# EAGLE design OSO-RING-B1-00 (never fabbed) (EAGLE 9.6.2)
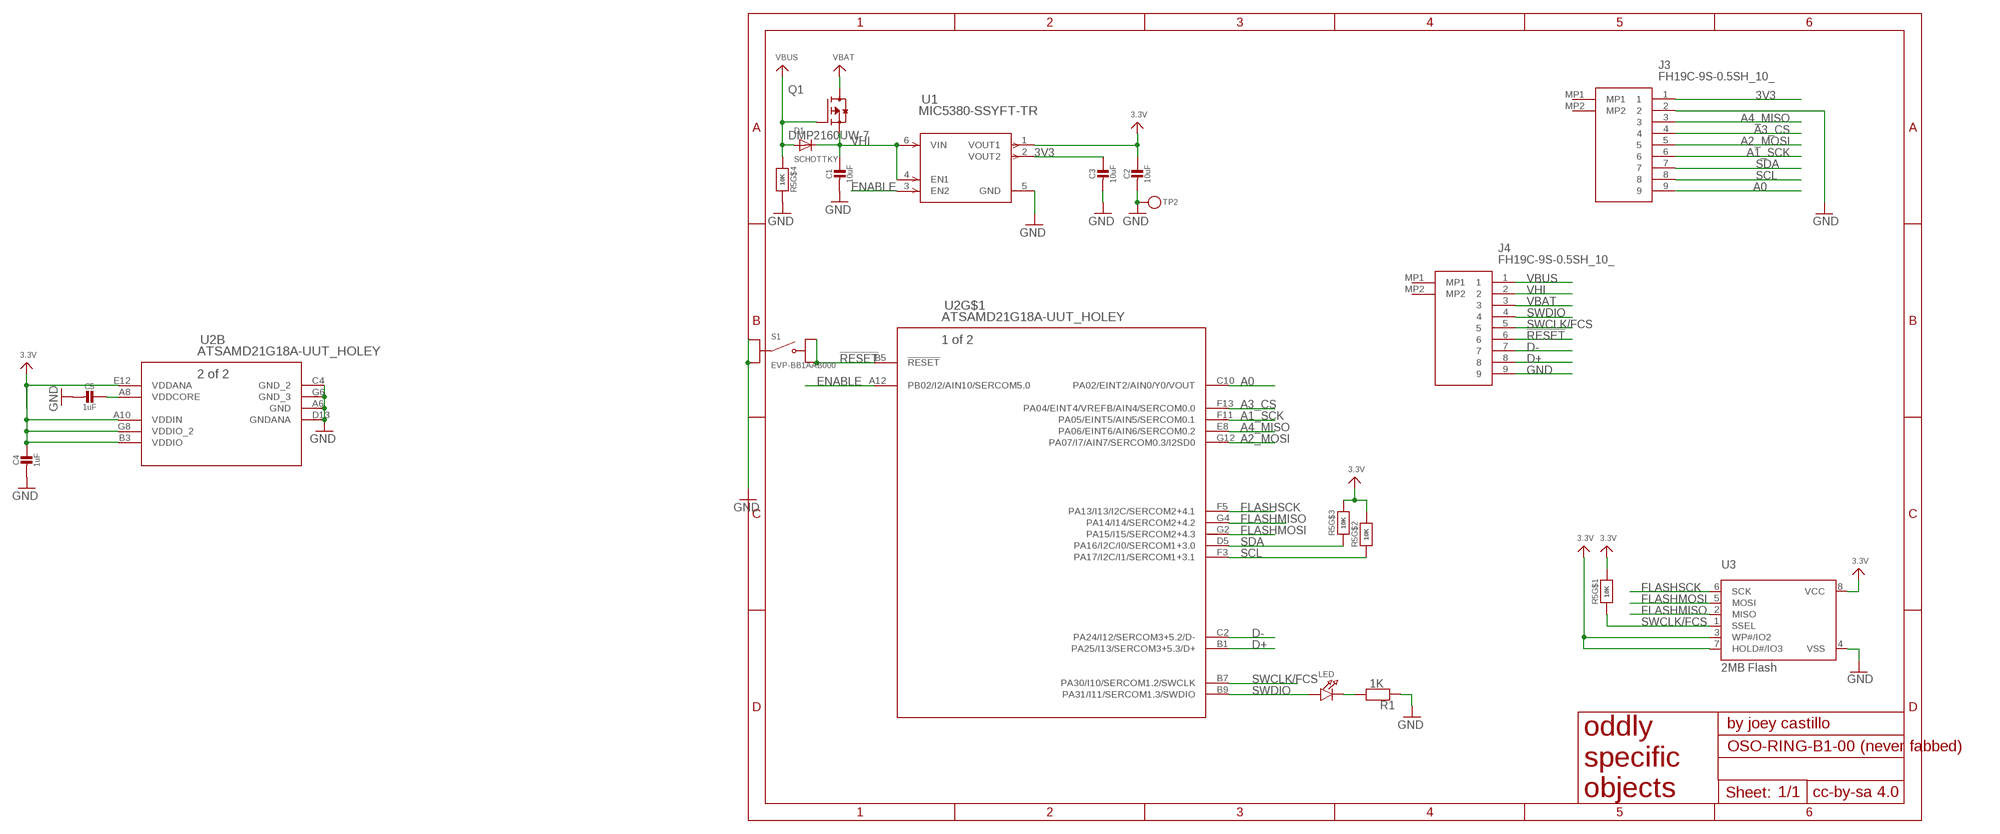
[diagram p0: schematic, sheet 1]

## Parts
C1  10uF  CAP_CERAMIC_0603MP  [_0603MP]
C2  10uF  CAP_CERAMIC_0603MP  [_0603MP]
C3  10uF  CAP_CERAMIC_0603MP  [_0603MP]
C4  1uF  CAP_CERAMIC_0603MP  [_0603MP]
C5  1uF  CAP_CERAMIC_0603MP  [_0603MP]
D1  SCHOTTKY  DIODESOD-323F  [SOD-323F]
J3  FH19C-9S-0.5SH_10_  [FH19C9S05SH10]
J4  FH19C-9S-0.5SH_10_  [FH19C9S05SH10]
LED  LED0603_NOOUTLINE  [CHIPLED_0603_NOOUTLINE]
Q1  DMP2160UW-7  [SOT65P210X110-3N]
R1  1K  RESISTOR_0603MP  [_0603MP]
R5  10K  EXB-V8V103JV-GOOD  [EXBV8V]
S1  EVP-BB1AAB000  [SW_EVP-BB1AAB000]
TP2  TESTPOINTPAD1MM  [TESTPOINT_PAD_1MM]
U1  MIC5380-SSYFT-TR  [TMLF-6_FT_MCH]
U2  ATSAMD21G18A-UUT_HOLEY  [WLCSP45_2P6X2P9_HOLEY]
U3  2MB Flash  SPIFLASH_8PINUX  [USON8]

## Nets
3.3V: C2.1 C4.1 R5.6 R5.7 R5.8 U1.1(VOUT1) U2.A10(B:VDDIN) U2.B3(B:VDDIO) U2.E12(B:VDDANA) U2.G8(B:VDDIO_2) U3.3(WP#/IO2) U3.7(HOLD#/IO3) U3.8(VCC)
3V3: C3.1 J3.1 U1.2(VOUT2)
!RESET: J4.6 S1.B1 S1.B2 U2.B5(!RESET)
A0: J3.9 U2.C10(PA02/EINT2/AIN0/Y0/VOUT)
A1_SCK: J3.6 U2.F11(PA05/EINT5/AIN5/SERCOM0.1)
A2_MOSI: J3.5 U2.G12(PA07/I7/AIN7/SERCOM0.3/I2SD0)
A3_CS: J3.4 U2.F13(PA04/EINT4/VREFB/AIN4/SERCOM0.0)
A4_MISO: J3.3 U2.E8(PA06/EINT6/AIN6/SERCOM0.2)
D+: J4.8 U2.B1(PA25/I13/SERCOM3+5.3/D+)
D-: J4.7 U2.C2(PA24/I12/SERCOM3+5.2/D-)
ENABLE: U1.3(EN2) U2.A12(PB02/I2/AIN10/SERCOM5.0)
FLASHMISO: U2.G4(PA14/I14/SERCOM2+4.2) U3.2(MISO)
FLASHMOSI: U2.G2(PA15/I15/SERCOM2+4.3) U3.5(MOSI)
FLASHSCK: U2.F5(PA13/I13/I2C/SERCOM2+4.1) U3.6(SCK)
GND: C1.2 C2.2 C3.2 C4.2 C5.2 J3.2 J4.9 R1.1 R5.5 S1.A1 S1.A2 TP2.P$1 U1.5(GND) U2.A6(B:GND) U2.C4(B:GND_2) U2.D13(B:GNDANA) U2.G6(B:GND_3) U3.4(VSS)
N$1: LED.C R1.2
SCL: J3.8 R5.2 U2.F3(PA17/I2C/I1/SERCOM1+3.1)
SDA: J3.7 R5.3 U2.D5(PA16/I2C/I0/SERCOM1+3.0)
SWCLK/FCS: J4.5 R5.1 U2.B7(PA30/I10/SERCOM1.2/SWCLK) U3.1(SSEL)
SWDIO: J4.4 LED.A U2.B9(PA31/I11/SERCOM1.3/SWDIO)
VBAT: J4.3 Q1.3(D)
VBUS: D1.A J4.1 Q1.1(G) R5.4
VDDCORE: C5.1 U2.A8(B:VDDCORE)
VHI: C1.1 D1.C J4.2 Q1.2(S) U1.4(EN1) U1.6(VIN)
Unconnected: J3.MP1 J3.MP2 J4.MP1 J4.MP2

## Library data of the parts
C1-C5 = microbuilder:CAP_CERAMIC: Ceramic Capacitors For new designs, use the packages preceded by an '_' character since they are more reliable: The following footprints should be used on most boards: _0402 - Standard footprint for regular board layouts _0603 - Standard footprint for regular board layouts _0805 - Standard footprint for regular board layouts _1206 - Standard footprint for regular board layouts For extremely tight-pitch boards where space is at a premium, the following 'micro-pitch' footprints can be used (smaller pads, no silkscreen outline, etc.): _0402MP - Micro-pitch footprint for very dense/compact boards _0603MP - Micro-pitch footprint for very dense/compact boards _0805MP - Micro-pitch footprint for very dense/compact boards _1206MP - Micro-pitch footprint for very dense/compact boards
D1 = adafruit:DIODE: Diode SMADIODE - SMA Surface Mount Package 20V 1A Schottky Diode Digikey: 641-1014-6-ND DO-1N4148 - Through Hole Small Current Diode SOD-123 20V 1 A (.5mV Vf) Schottky Diode - Digikey: MBRX120TPMSCT-ND SOD-323 10V 570mA (.38mV Vf, 3ns) Schottky Diode - Digikey: ZLLS410CT-ND SOD-523 30V 30mA Schottky Diode (RB751S-40TE61) - Digikey: RB751S-40TE61CT-ND SOT23-R/W - SOT23 Package (R = Solder Paste/Reflow Ovens, W = Hand-Soldering) BAT54Film 40V 300mA - Digikey: 497-7162-1-ND
J3 J4 = FH19C-9S-0.5SH:FH19C-9S-0.5SH_10_: CONN FFC BOTTOM 9POS 0.50MM R/A Source: Datasheet <https://componentsearchengine.com/Datasheets/1/FH19C-9S-0.5SH(10).pdf>; DESCRIPTION: CONN FFC BOTTOM 9POS 0.50MM R/A; HEIGHT: 1mm; MANUFACTURER_NAME: Hirose; MANUFACTURER_PART_NUMBER: FH19C-9S-0.5SH(10); MOUSER_PART_NUMBER: 798-FH19C9S05SH10; MOUSER_PRICE-STOCK: https://www.mouser.co.uk/ProductDetail/Hirose-Connector/FH19C-9S-05SH10?qs=vnk2wBG9e15bX8eK%2FvDSMA%3D%3D
LED = My Stuff:LED: LED 0603 - 0603 Surface Mount Package 2mA: Green LED - Low Power (3.9mcd, 2ma, 1.7Vf) - Digikey: 475-2709-2-ND Orange LED - Low Power (9.8mcd, 2ma, 1.8Vf) - Digikey: 475-1194-2-ND Red LED - Low Power (5mcd, 2ma, 1.8Vf) - Digikey: 475-1195-2-ND Yellow LED - Low Power (7mcd, 2ma, 1.8Vf) - Digikey: 475-1196-2-ND 5mA: Blue LED - Low Power (17mcd, 5ma, 2.9Vf) - Digikey: LNJ937W8CRACT-ND 0805 - 0805 Surface Mount Package 2mA: Red LED (8.8mcd, 2mA, 1.8Vf, Clear) - Low Power [Digikey: 475-2510-1-ND] Green LED (5mcd, 2mA, 1.8Vf, Clear) - Low Power [Digikey: 475-2730-1-ND] Yellow LED (11.3mcd, 2mA, 1.8Vf, Clear) - Low Power [Digikey: 475-2555-1-ND] 20mA: Red LED (104mcd, 20mA, Diffused) - LS R976 [Digikey: 475-1278-6-ND] Red LED (12mcd, 20mA, 2.0Vf, Clear) - APT2012EC [Digikey: 754-1128-1-ND] Green LED (15mcd, 20mA, 2.2Vf, Clear) - APT2012GC [Digikey: 754-1131-1-ND] Orange LED (160mcd, 20mA, 2.1Vf, Clear) - APT2012SECK [Digikey: 754-1130-1-ND] 1206 - 1206 Surface Mount Package Green LED (26mcd, 20mA, Diffused) - LG N971 [Digikey: 475-1407-6-ND] Red LED (15mcd, 20mA, Diffused) - LH N974 [Digikey: 475-1416-6-ND] Cree - Cree High-Power Surface Mount LEDs XPEBWT-L1-0000-00D50 - White 111lm 350mA 2.9Vf 6200K 110° XTEAWT-00-0000-00000LEE3 - White 114lm 350mA 2.85Vf 5000K 115° Everlight - Everlight 45-21 Series Surface Mount LEDs 45-21/QK2C-B2832AC2CB2/2T - Warm White 2000mcd 20mA 3.25Vf 3050K 120° 45-21/LK2C-B38452C4CB2/2T - Nuetral White 2000mcd 20mA 3.25Vf 4150K 120° 45-21/LK2C-B50634C6CB2/2T - Cold White 2200mcd 20mA 3.25Vf 5650K 120° PLCC2 Reverse Mount LS T77K-J1L2-1-0-2-R18-Z - Red 11.25mcd 2mA 1.8Vf 630nm 120° LO T77K-L1M2-24-Z - Orange 19.6mcd 2mA 1.8Vf 606nm 120° LY T77K-K2M1-26-Z - Yellow 15.7mcd 2mA 1.8Vf 587nm 120°
Q1 = DMP2160UW-7:DMP2160UW-7: DMP2160UW Series 20 V 100 mOhm P-Channel Enhancement Mode Mosfet - SOT-323; DESCRIPTION: P-Channel 20V 1.5A (Ta) 350mW (Ta) Surface Mount SOT-323; DIGI-KEY_PART_NUMBER: DMP2160UWDICT-ND; MF: Diodes Inc.; MP: DMP2160UW-7; PACKAGE: SOT-323 Diodes Inc.
R1 = microbuilder:RESISTOR: Resistors For new designs, use the packages preceded by an '_' character since they are more reliable: The following footprints should be used on most boards: _0402 - Standard footprint for regular board layouts _0603 - Standard footprint for regular board layouts _0805 - Standard footprint for regular board layouts _1206 - Standard footprint for regular board layouts For extremely tight-pitch boards where space is at a premium, the following 'micro-pitch' footprints can be used (smaller pads, no silkscreen outline, etc.): _0402MP - Micro-pitch footprint for very dense/compact boards _0603MP - Micro-pitch footprint for very dense/compact boards _0805MP - Micro-pitch footprint for very dense/compact boards _1206MP - Micro-pitch footprint for very dense/compact boards
R5 = resistor array:EXB-V8V103JV-GOOD; MANUFACTURER_PART_NUMBER: EXBV8V103JV; VENDOR: Panasonic
S1 = EVP-BB1AAB000:EVP-BB1AAB000: SWITCH TACTILE SPST-NO 0.02A 15V; DESCRIPTION: Tactile Switch SPST-NO Top Actuated Surface Mount; DIGI-KEY_PART_NUMBER: P124390CT-ND; MF: Panasonic Electronic Components; MP: EVP-BB1AAB000; PACKAGE: None; PURCHASE-URL: https://pricing.snapeda.com/search/part/EVP-BB1AAB000/?ref=eda
TP2 = pygamer-microbuilder:TESTPOINT: Test Point Various test points for characterisation and PCB testing TESTPOINT_SMT - Compact Surface Mount Test Point [Digikey: 5016KTR-ND]
U1 = MIC5380SSYFTTR:MIC5380-SSYFT-TR; BUILT_BY: EMA_Jessica; COPYRIGHT: Copyright (C) 2018 Accelerated Designs. All rights reserved; MANUFACTURER_PART_NUMBER: MIC5380-SSYFT-TR; SOURCELIBRARY: Microchip_2019-08-23_3; VENDOR: Microchip
U2 = ATSAMD21G18A-UUT:ATSAMD21G18A-UUT_HOLEY
U3 = microbuilder:SPIFLASH_8PIN: SOIC8 SPI Flash Be careful with the size since SOIC8 flash comes in several 'widths' SOIC8 150 mil M25P16 - 16Mbit (2Mbit x 8) Serial Flash (75MHz SPI Bus), Supply: 2.7-3.6V Digikey: SOIC8 - M25P16-VMN6P-ND SOIC8 208 mil W25Q16BVSSIG - 16Mbit (2Mbit x 8) Serial Flash (104MHz SPI Bus), Supply: 2.7-3.6V Digikey: SOIC8 - W25Q16BVSSIG-ND

## Net classes
1 power: width 0.305 mm

## Board
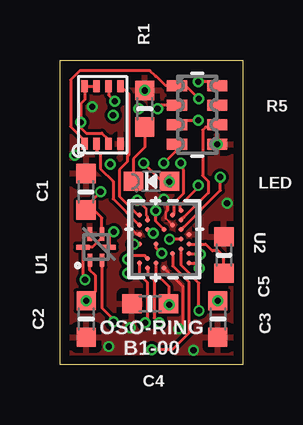
[diagram p1: board, top side]
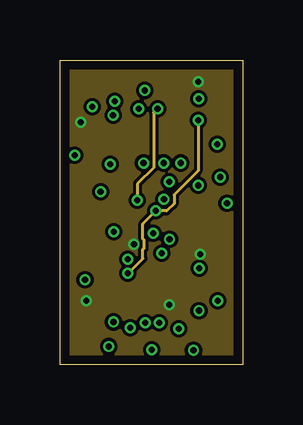
[diagram p2: board, inner layer Route2]
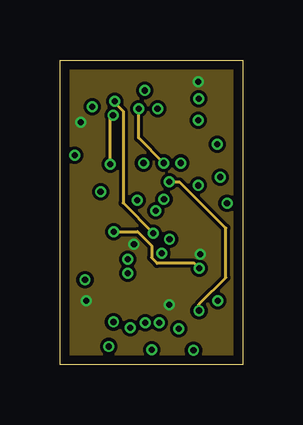
[diagram p3: board, inner layer Route15]
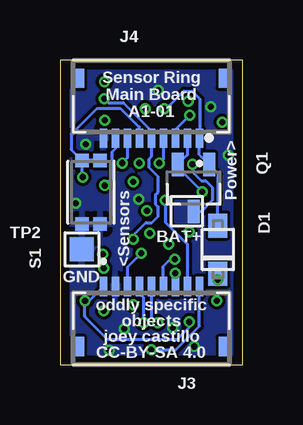
[diagram p4: board, bottom side, seen from below]

Size 7.62 x 12.7 mm. Coordinates in mm from the lower left corner, seen from the top.
Outline: 7.62,12.7 7.62,0 0,0 0,12.7 7.62,12.7
Copper layers (1*2*15*16): Top 0.035559375mm / dielectric 0.17018125mm / Route2 0.01778125mm / dielectric 47mil / Route15 0.01778125mm / dielectric 0.17018125mm / Bottom 0.035559375mm
Design rules "oshpark-4layer *": minimum track width 4mil, minimum drill 8mil, track to track 5mil, track to pad 5mil, pad to pad 5mil, via to via 5mil, smd to smd 5mil, copper to edge 15mil, drill to drill 6mil, minimum pad ring 4mil, minimum via ring 4mil, stop-mask expansion 1.5mil, vias tented up to drill 10mil, thermal gap 10mil

### Footprints (pad centres in the part's own frame; a part is rotated, then mirrored left to right if it is on the bottom)
_0603MP = smd 0.8 x 0.8: 1 -0.762,0; 2 0.762,0
SOD-323F = smd 1 x 0.8: A -1,0; C 1,0
FH19C9S05SH10 = smd 0.3 x 0.8: 1 -2,2.5; 2 -1.5,2.5; 3 -1,2.5; 4 -0.5,2.5; 5 0,2.5; 6 0.5,2.5; 7 1,2.5; 8 1.5,2.5; 9 2,2.5 | smd 0.4 x 0.8: MP1 -3,0; MP2 3,0
CHIPLED_0603_NOOUTLINE = smd 0.8 x 0.8: A 0,-0.75; C 0,0.75
SOT65P210X110-3N = smd 0.97 x 0.5: 1 -0.98,0.65; 2 -0.98,-0.65; 3 0.98,0
EXBV8V = smd 0.838 x 0.457: 1 -0.838,1.219; 2 -0.838,0.406; 3 -0.838,-0.406; 4 -0.838,-1.219; 5 0.838,-1.219; 6 0.838,-0.406; 7 0.838,0.406; 8 0.838,1.219
SW_EVP-BB1AAB000 = smd 0.55 x 0.55: A1 -1.325,0.375; A2 -1.325,-0.375; B1 1.325,0.375; B2 1.325,-0.375
TESTPOINT_PAD_1MM = smd 1 x 1: P$1 0,0
TMLF-6_FT_MCH = smd 0.559 x 0.203: 1 -0.546,0.25; 2 -0.546,-0.25; 4 0.546,-0.25; 5 0.546,0.25 | smd 0.203 x 0.559: 3 0,-0.546; 6 0,0.546
WLCSP45_2P6X2P9_HOLEY = smd 0.203 x 0.203: A6 -0.2,1.04; A8 0.2,1.04; A10 0.6,1.04; A12 1,1.04; B1 -1.2,0.693; B3 -0.8,0.693; B5 -0.4,0.693; B7 0,0.693; B9 0.4,0.693; C2 -1,0.346; C4 -0.6,0.346; C10 0.6,0.346; D5 -0.4,0; D13 1.2,0; E8 0.2,-0.346; E12 1,-0.346; F3 -0.8,-0.693; F5 -0.4,-0.693; F11 0.8,-0.693; F13 1.2,-0.693; G2 -1,-1.04; G4 -0.6,-1.04; G6 -0.2,-1.04; G8 0.2,-1.04; G12 1,-1.04
USON8 = smd 0.5 x 0.275: 1 -1.2,0.75; 2 -1.2,0.25; 3 -1.2,-0.25; 4 -1.2,-0.75; 5 1.2,-0.75; 6 1.2,-0.25; 7 1.2,0.25; 8 1.2,0.75

### Placement (x,y rotation side)
C1  1.09,7.21 90 top
C2  1.09,1.9 270 top
C3  6.58,1.9 270 top
C4  3.76,2.54 180 top
C5  6.83,4.57 90 top
D1  1.04,4.8 270 bottom
J3  3.81,0.76 0 bottom
J4  3.81,11.94 180 bottom
LED  3.81,7.65 90 top
Q1  2.06,7.37 270 bottom
R1  3.53,10.67 270 top
R5  5.71,10.41 0 top
S1  6.32,7.19 90 bottom
TP2  6.71,4.81 0 bottom
U1  1.5,4.9 90 top
U2  4.34,5.23 270 top
U3  1.78,10.41 90 top

### Tracks (layer width: path | path; a pad name or v marks a point on that pad's centre or on a via)
3.3V  (via drill 0.25)
  Top 0.127: U2.E12 4,3.8 4.52,3.28 C4.1 v4.56,2.51 | U3.7 U3.8 1.03,11.04 0.86,10.87 v0.86,10.11 0.86,9.88 1.09,9.65 1.74,9.65 2.03,9.37 U3.3 | v5.77,11.79 6.4,11.79 R5.8 R5.7 R5.6 6.45,9.91 6.07,9.91 5.94,9.78 5.94,7.88 6.18,7.65 6.18,7.16 5.16,6.14 5.14,6.14 U2.B3 | U1.1 1.25,3.95 1.48,3.72 1.48,3.05 C2.1 | U2.G8 v3.08,5.03 | U2.A10 5.82,4.63 v5.84,4.61
  other vias: 1.09,2.67
  pour Route15: -1.27,14.48 7.62,14.48 7.62,0 -1.27,0
  pour Route2: -1.52,14.48 7.62,14.48 7.62,0 -1.52,0
3V3  (via drill 0.25)
  Top 0.127: U1.2 1.75,2.37 2.23,1.89 v2.23,1.78
  Bottom 0.127: J3.1 6.41,2.67 C3.1 6.58,2.01 5.62,1.05 2.75,1.05 2.23,1.57 v2.23,1.78
  other vias: 6.58,2.67
!RESET  (via drill 0.25)
  Top 0.127: U2.B5 5.14,5.74 5.16,5.74 6.68,7.26 v6.68,7.82
  Bottom 0.127: v6.68,7.82 6.7,7.84 S1.B1 7.16,8.97 7.16,9.61 6.1,10.67 5.08,10.67 4.31,9.9 J4.6
  Bottom 0.152: S1.B1 S1.B2
A0  (via drill 0.25)
  Top 0.127: U2.C10 4.69,4.13 5.37,3.45 5.37,1.32 4.67,0.63 v3.82,0.63
  Bottom 0.127: v3.82,0.63 2.79,0.63 1.81,1.61 J3.9
A1_SCK  (via drill 0.25)
  Top 0.127: U2.F11 3.54,4.55 2.98,4.55 v2.83,4.39
  Bottom 0.127: v2.83,4.39 3.03,4.39 3.31,4.12 J3.6
A2_MOSI  (via drill 0.25)
  Top 0.127: v3.56,1.75 3.63,1.83 3.63,3.44 3.3,3.77 U2.G12
  Bottom 0.127: J3.5 3.81,2.01 v3.56,1.75
A3_CS  (via drill 0.25)
  Top 0.127: U2.F13 3.65,3.79 3.92,3.51 3.92,1.96 v4.14,1.74
  Bottom 0.127: v4.14,1.74 4.14,2.79 4.31,2.95 J3.4
A4_MISO  (via drill 0.25)
  Top 0.127: U2.E8 4,4.88 v4.23,4.64
  Bottom 0.127: v4.23,4.64 4.81,4.07 J3.3
D+  (via drill 0.25)
  Top 0.127: v5.76,7.47 5.76,7.39 5,6.63 5,6.47 U2.B1
  Bottom 0.127: J4.8 5.31,9.01 5.46,8.85 5.46,7.77 v5.76,7.47
D-  (via drill 0.25)
  Top 0.127: U2.C2 4.74,6.28 4.74,6.73 5.15,7.14 5.15,8.12 5.03,8.25 v5.03,8.41
  Bottom 0.127: J4.7 4.81,8.63 v5.03,8.41
ENABLE  (via drill 0.25)
  Top 0.127: U2.A12 5.59,4.23 v5.8,4.02 | v2.23,5.54 2.04,5.36 U1.3
  Route15 0.127: v5.8,4.02 5.6,4.22 4.05,4.22 3.81,4.46 3.81,4.97 3.23,5.55 v2.24,5.55 v2.23,5.54
FLASHMISO
  Top 0.127: U3.2 1.53,8.91 1.68,8.76 1.68,8.17 2.21,7.64 2.21,6.91 U2.G4
FLASHMOSI
  Top 0.127: U3.5 2.86,11.29 2.86,8.74 2.81,8.69 2.81,8.46 2.47,8.12 2.47,7.02 3.25,6.23 U2.G2
FLASHSCK  (via drill 0.25)
  Top 0.127: U2.F5 3.8,5.49 v3.89,5.49 | U3.6 2.03,11.24 v2.29,10.98
  Route15 0.127: v2.29,10.98 2.29,10.91 2.63,10.57 2.63,6.74 v3.89,5.49
GND  (via drill 0.25)
  Top 0.102: 4.68,5.83 4.4,6.11 4.4,6.36 4.49,6.44
  Top 0.127: U2.D13 5.11,3.26 5.11,1.66 v4.95,1.5 | U2.G6 3.2,5.43 2.79,5.84 | U2.C4 4.68,5.83 | v4.33,6.89 4.49,6.74 4.49,6.44
  other vias: 3.53,11.43 2.03,0.76 5.56,0.61 2.92,1.55 1.35,10.74 0.61,8.74 6.96,6.73 6.55,9.19
  pour Top: -1.27,14.48 7.62,14.48 7.62,0 -1.27,0
  pour Bottom (rank 3): -1.27,14.48 7.62,14.48 7.62,0 -1.27,0
N$1
  Top 0.127: LED.C 3.06,8.58 3.53,9.06 R1.2
SCL  (via drill 0.25)
  Top 0.102: 3.65,6.17 3.58,6.24 3.58,6.51
  Top 0.127: R5.2 4.22,10.82 v4.06,10.67 | v3.23,6.86 3.58,6.51 | U2.F3 3.65,6.17
  Route2 0.127: v3.23,6.86 3.23,7.54 3.9,8.21 3.9,10.5 v4.06,10.67
  Bottom 0.127: J3.8 2.31,5.03 3.23,5.94 v3.23,6.86
SDA  (via drill 0.25)
  Top 0.127: R5.3 5.03,10.16 5.71,10.16 v5.75,10.19 v5.76,10.19 | U2.D5 4,5.98 v4,6.41
  Route2 0.127: v2.82,3.81 2.85,3.81 3.45,4.42 3.45,4.81 3.5,4.86 3.5,5.2 3.45,5.25 3.45,5.87 v4,6.41 4.45,6.41 4.75,6.72 4.75,7.08 5.76,8.09 v5.76,10.19
  Bottom 0.127: v2.82,3.81 2.82,3.27 J3.7
SWCLK/FCS  (via drill 0.25)
  Top 0.127: U2.B7 v4.57,5.23 v4.56,5.23 | U3.1 1.03,9.34 0.44,9.93 0.44,11.87 0.83,12.25 3.75,12.25 3.98,12.02 4.01,12.02 4.4,11.63 R5.1 5.23,11.63 v5.78,11.09
  Bottom 0.127: v4.56,5.23 4.56,5.41 4.04,5.92 3.79,5.92 3.54,6.17 3.54,6.59 3.65,6.69 3.65,7.09 3.56,7.18 3.56,7.87 3.9,8.21 3.9,8.58 3.81,8.67 J4.5 3.81,9.76 4.97,10.92 5.61,10.92 v5.78,11.09
SWDIO  (via drill 0.25)
  Top 0.127: U2.B9 5.04,4.16 5.79,3.4 v5.79,2.26 | v3.48,8.41 4.24,7.64 LED.A v4.56,7.62
  Route15 0.127: v5.79,2.26 5.79,2.51 6.91,3.63 6.91,5.69 4.98,7.62 v4.56,7.62
  Bottom 0.127: J4.4 3.31,8.58 v3.48,8.41
VBAT  (via drill 0.25)
  Route15 0.127: v2.1,8.36 2.1,10.29 v2.21,10.4
  Bottom 0.127: v2.21,10.4 2.81,9.8 J4.3 | v2.1,8.36 2.1,8.03 1.74,7.67 1.55,7.67 1.27,7.39 1.27,6.86 1.74,6.39 Q1.3
  pour Bottom (rank 2, no thermals): 2.08,6.81 2.81,6.81 2.81,5.96 2.08,5.96
VBUS  (via drill 0.25)
  Top 0.127: R5.4 4.88,8.97 v4.32,8.41
  Route15 0.127: v4.32,8.41 3.27,9.45 v3.27,10.67
  Bottom 0.127: D1.A 1.04,6.73 1.02,6.75 1.02,7.16 1.02,7.96 Q1.1 1.81,8.75 J4.1 1.79,9.46 1.79,11.08 2.11,11.4 2.46,11.4 3.19,10.67 v3.27,10.67
VDDCORE
  Top 0.127: U2.A8 6.06,5.03 6.35,4.74 6.6,4.74 6.83,4.51 C5.1
VHI  (via drill 0.25)
  Top 0.127: v1.69,7.21 1.08,6.61 C1.1 1.43,6.45 1.75,6.12 U1.4 1.75,5.3 1.35,4.9 U1.6 0.95,3.63 v1.04,3.55
  Bottom 0.127: J4.2 2.31,8.74 Q1.2 2.71,8.23 v1.69,7.21 | D1.C v1.04,3.55

### Text on the board
tPlace: OSO-RING / B1-00
bPlace: Sensor Ring / Main Board / A1-01 | Power> | BAT+ | <Sensors | GND | oddly specific / objects / joey castillo / CC-BY-SA 4.0 | 3V / GND / A4 / A3 / A2 / A1 / SDA / SCL / A0